# EAGLE design A13-LCD7'' (EAGLE 4.16)
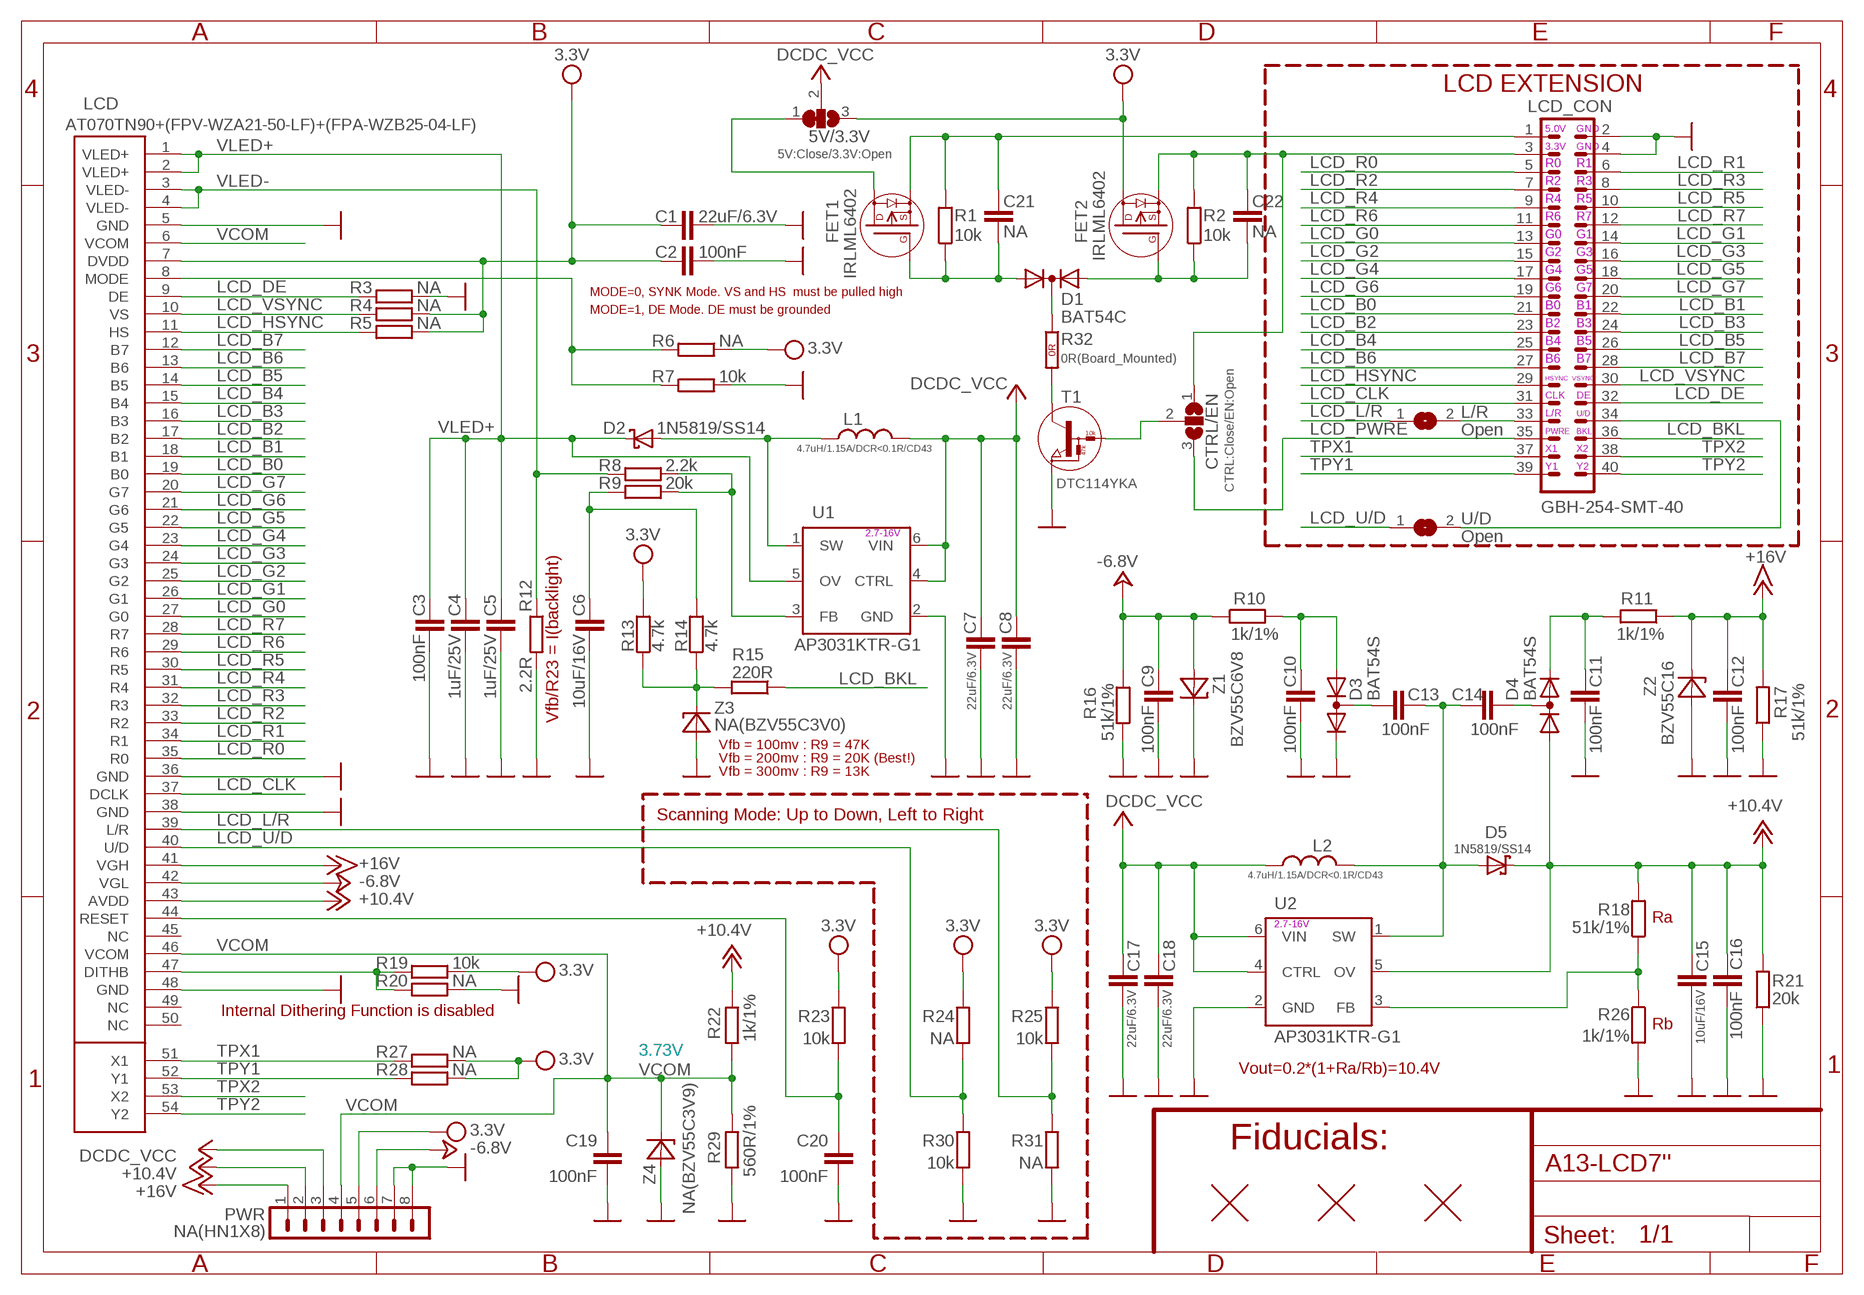
[diagram p0: schematic, sheet 1]

## Parts
5V/3.3V  5V:Close/3.3V:Open  SJ2W3  [SJ_2_SMALL]
C1  22uF/6.3V  C-EUC0805_5MIL_DWS  [C0805_5MIL_DWS]
C2  100nF  C-EUC0603_DWS  [C0603_DWS]
C3  100nF  C-EUC0603_DWS  [C0603_DWS]
C4  1uF/25V  C-EUC0805_5MIL_DWS  [C0805_5MIL_DWS]
C5  1uF/25V  C-EUC0805_5MIL_DWS  [C0805_5MIL_DWS]
C6  10uF/16V  C-EUC0805_5MIL_DWS  [C0805_5MIL_DWS]
C7  22uF/6.3V  C-EUC0805_5MIL_DWS  [C0805_5MIL_DWS]
C8  22uF/6.3V  C-EUC0805_5MIL_DWS  [C0805_5MIL_DWS]
C9  100nF  C-EUC0603_DWS  [C0603_DWS]
C10  100nF  C-EUC0603_DWS  [C0603_DWS]
C11  100nF  C-EUC0603_DWS  [C0603_DWS]
C12  100nF  C-EUC0603_DWS  [C0603_DWS]
C13  100nF  C-EUC0603_DWS  [C0603_DWS]
C14  100nF  C-EUC0603_DWS  [C0603_DWS]
C15  10uF/16V  C-EUC0805_5MIL_DWS  [C0805_5MIL_DWS]
C16  100nF  C-EUC0603_DWS  [C0603_DWS]
C17  22uF/6.3V  C-EUC0805_5MIL_DWS  [C0805_5MIL_DWS]
C18  22uF/6.3V  C-EUC0805_5MIL_DWS  [C0805_5MIL_DWS]
C19  100nF  C-EUC0603_DWS  [C0603_DWS]
C20  100nF  C-EUC0603_DWS  [C0603_DWS]
C21  NA  C-EUC0603_DWS  [C0603_DWS]
C22  NA  C-EUC0603_DWS  [C0603_DWS]
CTRL/EN  CTRL:Close/EN:Open  SJ2W3  [SJ_2_SMALL]
D1  BAT54C  DIODE_AC-CA_  [SOT23C]
D2  1N5819/SS14  SCHOTKKY7.62SS2  [MLL-41]
D3  BAT54S  DIODE_AC-AC_  [SOT23C(BAT54S)]
D4  BAT54S  DIODE_AC-AC_  [SOT23C(BAT54S)]
D5  1N5819/SS14  SCHOTKKY7.62SS2  [MLL-41]
FET1  IRLML6402  P-MOS+DIODIRLML6402  [SOT23]
FET2  IRLML6402  P-MOS+DIODIRLML6402  [SOT23]
L1  4.7uH/1.15A/DCR<0.1R/CD43  L-CD42(43)  [CD42(43)]
L2  4.7uH/1.15A/DCR<0.1R/CD43  L-CD42(43)  [CD42(43)]
L/R  Open  SJSJ_SMALLER  [SJ_1_SMALLER]
LCD  AT070TN90+(FPV-WZA21-50-LF)+(FPA-WZB25-04-LF)  LCD7"_TOUCH  [LCD7"_TOUCH(AT070TN90)]
LCD_CON  GBH-254-SMT-40  ML40-GBH-254-SMT-40  [ML40-MALE(GBH-254-SMT-40)]
PWR  NA(HN1X8)  CON8HN1X8  [HN1X8]
R1  10k  R-EU_R0603_5MIL_DWS  [R0603_5MIL_DWS]
R2  10k  R-EU_R0603_5MIL_DWS  [R0603_5MIL_DWS]
R3  NA  R-EU_R0603_5MIL_DWS  [R0603_5MIL_DWS]
R4  NA  R-EU_R0603_5MIL_DWS  [R0603_5MIL_DWS]
R5  NA  R-EU_R0603_5MIL_DWS  [R0603_5MIL_DWS]
R6  NA  R-EU_R0603_5MIL_DWS  [R0603_5MIL_DWS]
R7  10k  R-EU_R0603_5MIL_DWS  [R0603_5MIL_DWS]
R8  2.2k  R-EU_R0603_5MIL_DWS  [R0603_5MIL_DWS]
R9  20k  R-EU_R0603_5MIL_DWS  [R0603_5MIL_DWS]
R10  1k/1%  R-EU_R0603_5MIL_DWS  [R0603_5MIL_DWS]
R11  1k/1%  R-EU_R0603_5MIL_DWS  [R0603_5MIL_DWS]
R12  2.2R  R-EU_R0603_5MIL_DWS  [R0603_5MIL_DWS]
R13  4.7k  R-EU_R0603_5MIL_DWS  [R0603_5MIL_DWS]
R14  4.7k  R-EU_R0603_5MIL_DWS  [R0603_5MIL_DWS]
R15  220R  R-EU_R0603_5MIL_DWS  [R0603_5MIL_DWS]
R16  51k/1%  R-EU_R0603_5MIL_DWS  [R0603_5MIL_DWS]
R17  51k/1%  R-EU_R0603_5MIL_DWS  [R0603_5MIL_DWS]
R18  51k/1%  R-EU_R0603_5MIL_DWS  [R0603_5MIL_DWS]
R19  10k  R-EU_R0603_5MIL_DWS  [R0603_5MIL_DWS]
R20  NA  R-EU_R0603_5MIL_DWS  [R0603_5MIL_DWS]
R21  20k  R-EU_R0603_5MIL_DWS  [R0603_5MIL_DWS]
R22  1k/1%  R-EU_R0603_5MIL_DWS  [R0603_5MIL_DWS]
R23  10k  R-EU_R0603_5MIL_DWS  [R0603_5MIL_DWS]
R24  NA  R-EU_R0603_5MIL_DWS  [R0603_5MIL_DWS]
R25  10k  R-EU_R0603_5MIL_DWS  [R0603_5MIL_DWS]
R26  1k/1%  R-EU_R0603_5MIL_DWS  [R0603_5MIL_DWS]
R27  NA  R-EU_R0603_5MIL_DWS  [R0603_5MIL_DWS]
R28  NA  R-EU_R0603_5MIL_DWS  [R0603_5MIL_DWS]
R29  560R/1%  R-EU_R0603_5MIL_DWS  [R0603_5MIL_DWS]
R30  10k  R-EU_R0603_5MIL_DWS  [R0603_5MIL_DWS]
R31  NA  R-EU_R0603_5MIL_DWS  [R0603_5MIL_DWS]
R32  0R(Board_Mounted)  R_0R0R(NA)  [0603_0R]
T1  DTC114YKA  DIGITAL_TRANSISTORS-NPNDTC114YKA  [SOT-23]
U1  AP3031KTR-G1  [SOT23-6]
U2  AP3031KTR-G1  [SOT23-6]
U$1  FIDUCIAL1X2  [FIDUCIAL-1X2]
U$2  FIDUCIAL1X2  [FIDUCIAL-1X2]
U$3  FIDUCIAL1X2  [FIDUCIAL-1X2]
U/D  Open  SJSJ_SMALLER  [SJ_1_SMALLER]
Z1  BZV55C6V8  ZDIOD-SMD  [MINI-MELF]
Z2  BZV55C16  ZDIOD-SMD  [MINI-MELF]
Z3  NA(BZV55C3V0)  ZDIOD-SMD  [MINI-MELF]
Z4  NA(BZV55C3V9)  ZDIOD-SMD  [MINI-MELF]

## Nets
+5V: 5V/3.3V.2 C7.2 C8.2 C17.2 C18.2 L1.1 L2.1 PWR.3 U1.4(CTRL) U1.6(VIN) U2.4(CTRL) U2.6(VIN) ; supply symbol labelled DCDC_VCC
+12V: C15.1 C16.1 D4.1(A) D5.K(C) LCD.43(AVDD) PWR.2 R18.2 R21.2 R22.1 U2.5(OV) ; supply symbol labelled +10.4V
+15V: C12.1 LCD.41(VGH) PWR.1 R11.1 R17.2 Z2.1(C) ; supply symbol labelled +16V
-24V: C9.1 LCD.42(VGL) PWR.6 R10.1 R16.2 Z1.2(A) ; supply symbol labelled -6.8V
GND [pwr]: C1.2 C2.2 C3.2 C4.2 C5.2 C6.2 C7.1 C8.1 C9.2 C10.2 C11.2 C12.2 C15.2 C16.2 C17.1 C18.1 C19.2 C20.2 D3.2(K) LCD.5(GND) LCD.36(GND) LCD.38(GND) LCD.48(GND) LCD_CON.2 LCD_CON.4 PWR.7 PWR.8 R3.1 R7.1 R12.2 R16.1 R17.1 R20.1 R21.1 R26.2 R29.2 R30.2 R31.2 T1.2(E) U1.2(GND) U2.2(GND) Z1.1(C) Z2.2(A) Z3.2(A) Z4.2(A)
LCD_B0: LCD.19(B0) LCD_CON.21
LCD_B1: LCD.18(B1) LCD_CON.22
LCD_B2: LCD.17(B2) LCD_CON.23
LCD_B3: LCD.16(B3) LCD_CON.24
LCD_B4: LCD.15(B4) LCD_CON.25
LCD_B5: LCD.14(B5) LCD_CON.26
LCD_B6: LCD.13(B6) LCD_CON.27
LCD_B7: LCD.12(B7) LCD_CON.28
LCD_BKL: LCD_CON.36 R15.1
LCD_CLK: LCD.37(DCLK) LCD_CON.31
LCD_DE: LCD.9(DE) LCD_CON.32 R3.2
LCD_G0: LCD.27(G0) LCD_CON.13
LCD_G1: LCD.26(G1) LCD_CON.14
LCD_G2: LCD.25(G2) LCD_CON.15
LCD_G3: LCD.24(G3) LCD_CON.16
LCD_G4: LCD.23(G4) LCD_CON.17
LCD_G5: LCD.22(G5) LCD_CON.18
LCD_G6: LCD.21(G6) LCD_CON.19
LCD_G7: LCD.20(G7) LCD_CON.20
LCD_HSYNC: LCD.11(HS) LCD_CON.29 R5.2
LCD_L/R: L/R.1 LCD.39(L/R) R25.2 R31.1
LCD_PWRE: CTRL/EN.3 LCD_CON.35
LCD_R0: LCD.35(R0) LCD_CON.5
LCD_R1: LCD.34(R1) LCD_CON.6
LCD_R2: LCD.33(R2) LCD_CON.7
LCD_R3: LCD.32(R3) LCD_CON.8
LCD_R4: LCD.31(R4) LCD_CON.9
LCD_R5: LCD.30(R5) LCD_CON.10
LCD_R6: LCD.29(R6) LCD_CON.11
LCD_R7: LCD.28(R7) LCD_CON.12
LCD_U/D: LCD.40(U/D) R24.2 R30.1 U/D.1
LCD_VSYNC: LCD.10(VS) LCD_CON.30 R4.2
N$1: LCD.8(MODE) R6.2 R7.2
N$2: C14.2 D4.3(AK)
N$3 [pwr]: C22.1 CTRL/EN.1 FET2.2(S) LCD_CON.3 R2.2
N$4: C11.1 D4.2(K) R11.2
N$5: R8.1 R9.1 U1.3(FB)
N$6: C10.1 D3.1(A) R10.2
N$7: C21.1 FET1.2(S) LCD_CON.1 R1.2
N$8: C22.2 D1.1(A1) FET2.1(G) R2.1
N$9: C21.2 D1.2(A2) FET1.1(G) R1.1
N$10: C13.1 D3.3(AK)
N$11: R32.2(1.2) T1.3(C)
N$12: C6.1 R9.2 R14.2
N$13: D2.A L1.2 U1.1(SW)
N$14: R13.1 R14.1 R15.2 Z3.1(C)
N$15: L/R.2 LCD_CON.33
N$16: CTRL/EN.2 T1.1(B)
N$17: LCD_CON.34 U/D.2
N$18: 5V/3.3V.1 FET1.3(D)
N$19: D1.3(K) R32.1(1.1)
N$42: LCD.47(DITHB) R19.2 R20.2
N$123: C13.2 C14.1 D5.A L2.2 U2.1(SW)
N$126: R18.1 R26.1 U2.3(FB)
RESET: C20.1 LCD.44(RESET) R23.2
TPX1: LCD.51(X1) LCD_CON.37 R27.2
TPX2: LCD.53(X2) LCD_CON.38
TPY1: LCD.52(Y1) LCD_CON.39 R28.2
TPY2: LCD.54(Y2) LCD_CON.40
VCC [pwr]: 5V/3.3V.3 C1.1 C2.1 FET2.3(D) LCD.7(DVDD) PWR.5 R4.1 R5.1 R6.1 R13.2 R19.1 R23.1 R24.1 R25.1 R27.1 R28.1 ; supply symbol labelled 3.3V
VCOM: C19.1 LCD.6(VCOM) LCD.46(VCOM) PWR.4 R22.2 R29.1 Z4.1(C)
VLED+: C3.1 C4.1 C5.1 D2.K(C) LCD.1(VLED+) LCD.2(VLED+) U1.5(OV)
VLED-: LCD.3(VLED-) LCD.4(VLED-) R8.2 R12.1
Unconnected: LCD.45(NC) LCD.49(NC) LCD.50(NC)

## Notes on the sheet
- LCD EXTENSION
- 5.0V | GND
- 3.3V | GND
- R0 | R1
- R2 | R3
- R4 | R5
- R6 | R7
- G0 | G1
- G2 | G3
- G4 | G5
- G6 | G7
- MODE=0, SYNK Mode. VS and HS  must be pulled high
- B0 | B1
- MODE=1, DE Mode. DE must be grounded
- B2 | B3
- B4 | B5
- B6 | B7
- HSYNC | VSYNC
- CLK | DE
- L/R | U/D
- PWRE | BKL
- X1 | X2
- Y1 | Y2
- 2.7-16V
- Vfb/R23 = I(backlight)
- Vfb = 100mv : R9 = 47K
- Vfb = 200mv : R9 = 20K (Best!)
- Vfb = 300mv : R9 = 13K
- Scanning Mode: Up to Down, Left to Right
- Ra
- 2.7-16V
- Internal Dithering Function is disabled
- Rb
- 3.73V
- Vout=0.2*(1+Ra/Rb)=10.4V
- Fiducials:

## Library data of the parts
5V/3.3V CTRL/EN = jumper:SJ2W: SMD solder JUMPER
C1-C22 = rcl:C-EU: CAPACITOR, European symbol
D1 = semicon-smd-ipc:DIODE_AC-CA_: DUAL DIODE
D2 D5 = gogo:SCHOTKKY7.62SS
D3 D4 = semicon-smd-ipc:DIODE_AC-AC_: DUAL DIODE
FET1 FET2 = Penko:P-MOS+DIOD
L1 L2 = OLIMEX_DISCRET:L
L/R U/D = jumper:SJ: SMD solder JUMPER
LCD = olimex_lcd:LCD7"_TOUCH
LCD_CON = con-harting-ml:ML40: HARTING
PWR = Penko:CON8
R1-R31 = rcl:R-EU_: RESISTOR, European symbol
R32 = OLIMEX_DISCRET:R_0R
T1 = OLIMEX_DISCRET:DIGITAL_TRANSISTORS-NPN: DTC114YKA Digital Transistor - NPN
U1 U2 = OLIMEX_IC:AP3031
U$1-U$3 = SparkFunEagle-6-6-07:FIDUCIAL: Fiducial Alignment Points Various fiducial points for machine vision alignment.
Z1-Z4 = gogo:ZDIOD-SMD

## Net classes
1 pwr: width 0.254 mm, drill 0.241 mm, clearance 0.254 mm

## Board
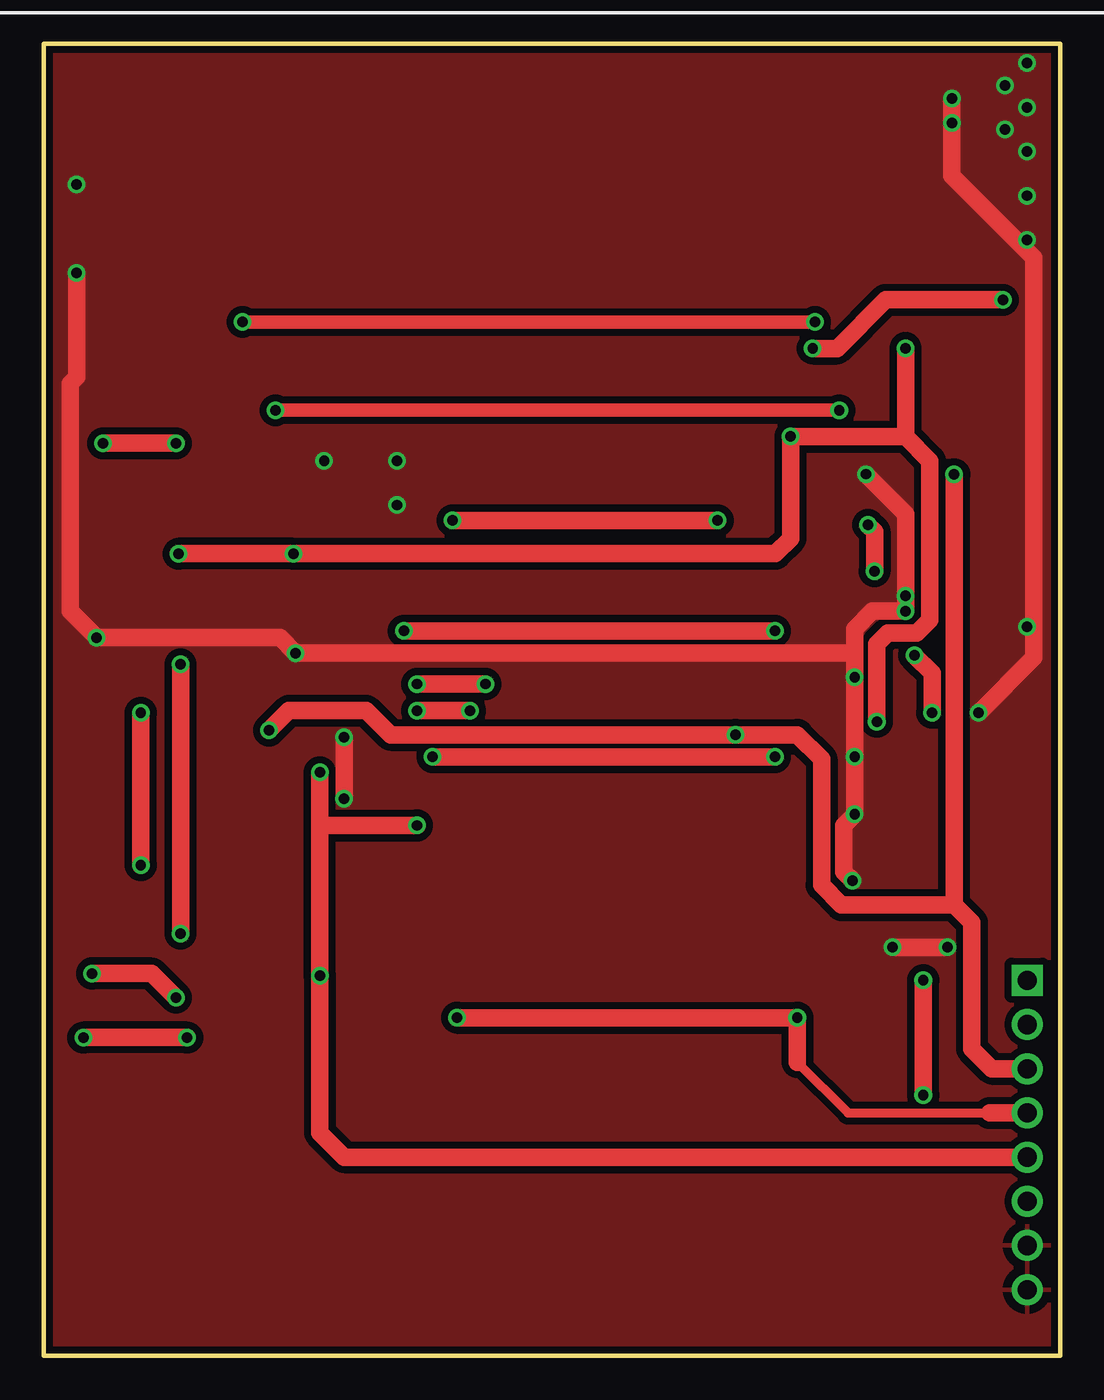
[diagram p1: board, top side]
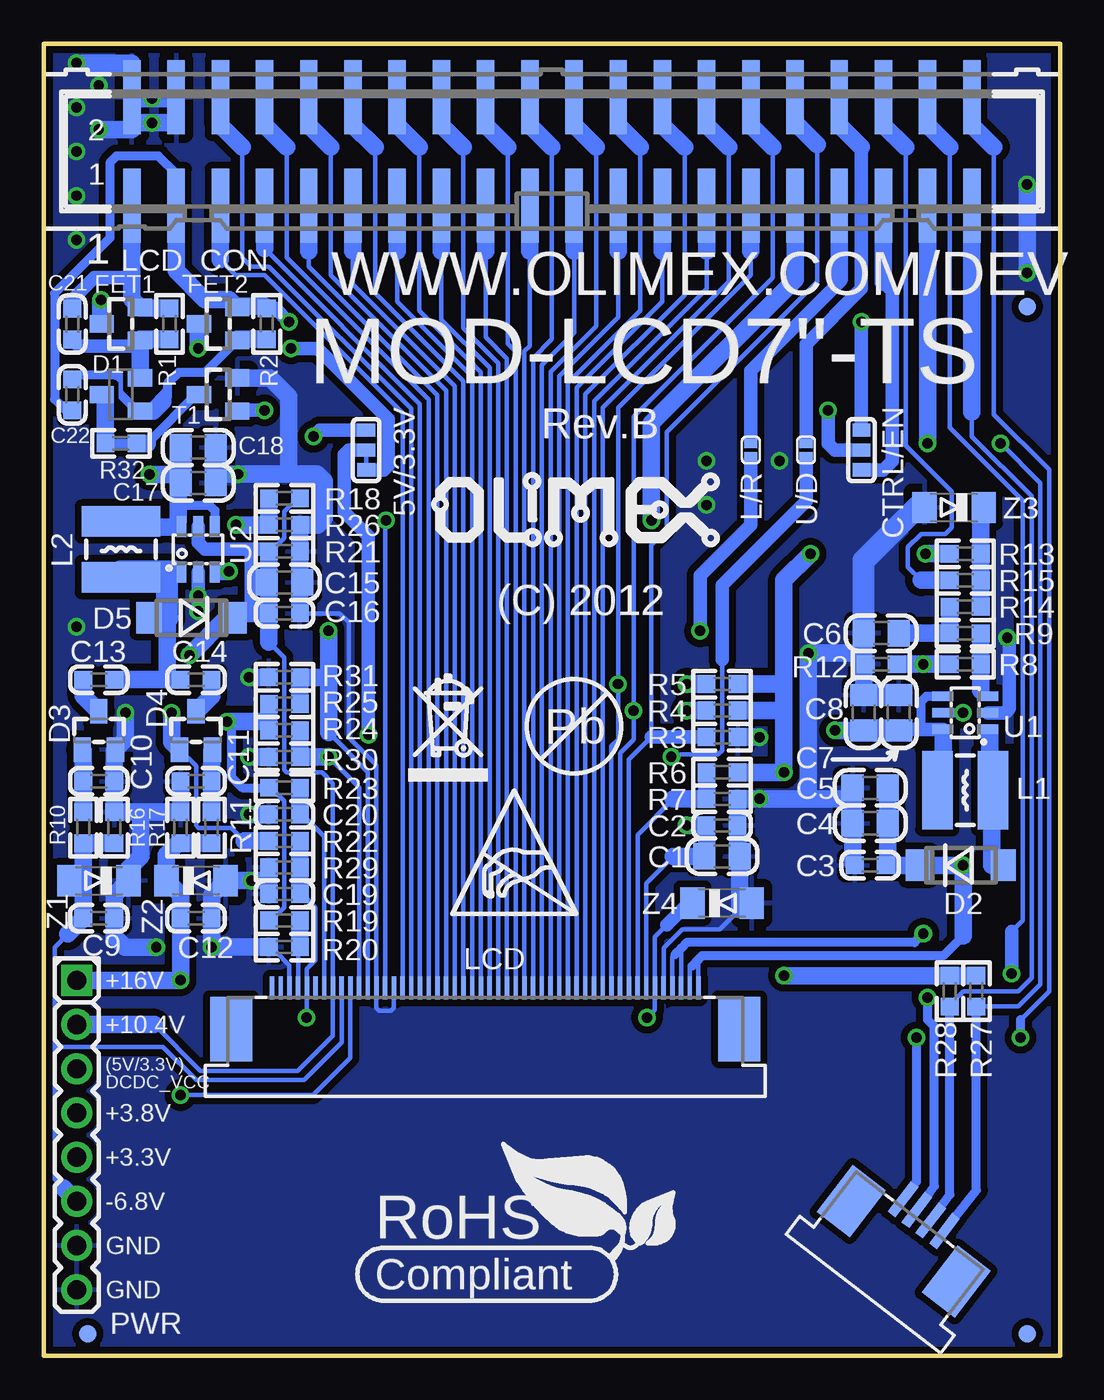
[diagram p2: board, bottom side, seen from below]

Size 58.42 x 75.44 mm. Coordinates in mm from the lower left corner, seen from the top.
Outline: 0,75.44 0,0 58.42,0 58.42,75.44 0,75.44
Copper layers (1+16): Top 0.035mm / dielectric 1.5mm / Bottom 0.035mm
Design rules "default": minimum track width 9.5mil, minimum drill 0.6mm, track to track 9.5mil, track to pad 9.5mil, pad to pad 9.5mil, via to via 10mil, smd to smd 1mil, copper to edge 10mil, drill to drill 8mil, minimum pad ring 8mil, minimum via ring 8mil, stop-mask expansion 4mil, vias tented up to drill 25mil, thermal gap 20mil

### Footprints (pad centres in the part's own frame; a part is rotated, then mirrored left to right if it is on the bottom)
SJ_2_SMALL = smd 0.762 x 1.016: 1 -1.143,0; 2 0,0; 3 1.143,0
C0805_5MIL_DWS = smd 1.27 x 1.524: 1 -1.016,0; 2 1.016,0
C0603_DWS = smd 1.016 x 1.016: 1 -0.889,0; 2 0.889,0
SOT23C = smd 1 x 1.4: 1 -0.95,-1.1; 2 0.95,-1.1; 3 0,1.1
MLL-41 = smd 1.45 x 1.8: A 2.445,0; K -2.445,0
SOT23C(BAT54S) = smd 1 x 1.4: 1 -0.95,-1.1; 2 0.95,-1.1; 3 0,1.1
SOT23 = smd 1 x 1.4: 1 -0.95,-1.1; 2 0.95,-1.1; 3 0,1.1
CD42(43) = smd 4.5 x 1.75: 1 0,1.6; 2 0,-1.6
SJ_1_SMALLER = smd 0.508 x 0.762: 1 -0.381,0; 2 0.381,0
LCD7"_TOUCH(AT070TN90) = smd 0.25 x 1.3 bottom: 1 69.05,40.45; 2 69.55,40.45; 3 70.05,40.45; 4 70.55,40.45; 5 71.05,40.45; 6 71.55,40.45; 7 72.05,40.45; 8 72.55,40.45; 9 73.05,40.45; 10 73.55,40.45; 11 74.05,40.45; 12 74.55,40.45; 13 75.05,40.45; 14 75.55,40.45; 15 76.05,40.45; 16 76.55,40.45; 17 77.05,40.45; 18 77.55,40.45; 19 78.05,40.45; 20 78.55,40.45; 21 79.05,40.45; 22 79.55,40.45; 23 80.05,40.45; 24 80.55,40.45; 25 81.05,40.45; 26 81.55,40.45; 27 82.05,40.45; 28 82.55,40.45; 29 83.05,40.45; 30 83.55,40.45; 31 84.05,40.45; 32 84.55,40.45; 33 85.05,40.45; 34 85.55,40.45; 35 86.05,40.45; 36 86.55,40.45; 37 87.05,40.45; 38 87.55,40.45; 39 88.05,40.45; 40 88.55,40.45; 41 89.05,40.45; 42 89.55,40.45; 43 90.05,40.45; 44 90.55,40.45; 45 91.05,40.45; 46 91.55,40.45; 47 92.05,40.45; 48 92.55,40.45; 49 93.05,40.45; 50 93.55,40.45 | smd 0.55 x 2.2 rotated 217.5 bottom: 51 54.913,26.473; 52 55.707,27.082; 53 56.5,27.691; 54 57.294,28.299 | smd 2.4 x 3.7 bottom: P1 95.9,38.075; P2 66.7,38.075 | smd 2.4 x 3.4 rotated 217.5 bottom: P3 60.275,28.192; P4 54.245,23.566
ML40-MALE(GBH-254-SMT-40) = smd 1 x 4.25: 1 -24.13,-3.125; 2 -24.13,3.125; 3 -21.59,-3.125; 4 -21.59,3.125; 5 -19.05,-3.125; 6 -19.05,3.125; 7 -16.51,-3.125; 8 -16.51,3.125; 9 -13.97,-3.125; 10 -13.97,3.125; 11 -11.43,-3.125; 12 -11.43,3.125; 13 -8.89,-3.125; 14 -8.89,3.125; 15 -6.35,-3.125; 16 -6.35,3.125; 17 -3.81,-3.125; 18 -3.81,3.125; 19 -1.27,-3.125; 20 -1.27,3.125; 21 1.27,-3.125; 22 1.27,3.125; 23 3.81,-3.125; 24 3.81,3.125; 25 6.35,-3.125; 26 6.35,3.125; 27 8.89,-3.125; 28 8.89,3.125; 29 11.43,-3.125; 30 11.43,3.125; 31 13.97,-3.125; 32 13.97,3.125; 33 16.51,-3.125; 34 16.51,3.125; 35 19.05,-3.125; 36 19.05,3.125; 37 21.59,-3.125; 38 21.59,3.125; 39 24.13,-3.125; 40 24.13,3.125
HN1X8 = drill 1.1 pad 1.778 square: 1 -8.89,0 | drill 1.1 pad 1.778 round: 2 -6.35,0; 3 -3.81,0; 4 -1.27,0; 5 1.27,0; 6 3.81,0; 7 6.35,0; 8 8.89,0
R0603_5MIL_DWS = smd 1.016 x 1.016: 1 -0.889,0; 2 0.889,0
0603_0R = smd 1.016 x 1.016: 1 -0.889,0; 2 0.889,0
SOT-23 = smd 1 x 1.4: 1 -0.95,-1.1; 2 0.95,-1.1; 3 0,1.1
SOT23-6 = smd 0.55 x 1.2: 1 -0.95,-1.3; 2 0,-1.3; 3 0.95,-1.3; 4 0.95,1.3; 5 0,1.3; 6 -0.95,1.3
FIDUCIAL-1X2 = smd 1 x 1: 1 0,0
MINI-MELF = smd 1.4 x 1.8: 1 -1.7,0; 2 1.7,0

### Placement (x,y rotation side)
5V/3.3V  39.88,52.07 90 bottom
C1  19.43,28.72 0 bottom
C2  19.43,30.5 0 bottom
C3  10.92,28.21 180 bottom
C4  10.92,30.62 180 bottom
C5  10.92,32.65 180 bottom
C6  10.29,41.54 180 bottom
C7  9.27,36.97 270 bottom
C8  11.3,36.97 270 bottom
C9  55.24,25.16 0 bottom
C10  55.24,33.03 0 bottom
C11  49.66,33.03 180 bottom
C12  49.66,25.16 0 bottom
C13  55.24,38.88 0 bottom
C14  49.66,38.88 0 bottom
C15  44.58,44.47 0 bottom
C16  44.58,42.69 0 bottom
C17  49.53,50.18 180 bottom
C18  49.53,52.21 180 bottom
C19  44.58,26.56 180 bottom
C20  44.58,31.13 180 bottom
C21  56.77,59.31 270 bottom
C22  56.77,55.24 90 bottom
CTRL/EN  11.43,52.07 270 bottom
D1  53.98,55.26 90 bottom
D2  5.71,28.21 0 bottom
D3  55.24,35.96 0 bottom
D4  49.66,35.96 0 bottom
D5  49.91,42.43 180 bottom
FET1  53.98,59.32 90 bottom
FET2  48.39,59.32 90 bottom
L1  5.46,32.53 90 bottom
L2  53.98,46.37 0 bottom
L/R  17.78,52.07 90 bottom
LCD  -48.26,-19.29 0 top
LCD_CON  29.21,69.23 0 bottom
PWR  56.52,12.7 270 bottom
R1  51.18,59.32 90 bottom
R2  45.59,59.32 90 bottom
R3  19.43,35.58 180 bottom
R4  19.43,37.1 180 bottom
R5  19.43,38.62 180 bottom
R6  19.43,33.54 180 bottom
R7  19.43,32.02 180 bottom
R8  5.46,39.77 180 bottom
R9  5.46,41.54 180 bottom
R10  56.13,30.37 90 bottom
R11  48.77,30.37 90 bottom
R12  10.29,39.77 180 bottom
R13  5.46,46.12 180 bottom
R14  5.46,43.07 180 bottom
R15  5.46,44.59 0 bottom
R16  54.36,30.37 270 bottom
R17  50.55,30.37 270 bottom
R18  44.58,49.29 0 bottom
R19  44.58,25.03 0 bottom
R20  44.58,23.51 0 bottom
R21  44.58,46.24 180 bottom
R22  44.58,29.61 0 bottom
R23  44.58,32.65 0 bottom
R24  44.58,35.96 0 bottom
R25  44.58,37.48 0 bottom
R26  44.58,47.77 0 bottom
R27  4.83,20.97 270 bottom
R28  6.35,20.97 270 bottom
R29  44.58,28.08 180 bottom
R30  44.58,34.43 180 bottom
R31  44.58,39 180 bottom
R32  53.98,52.45 0 bottom
T1  48.39,55.26 90 bottom
U1  5.46,36.97 90 bottom
U2  49.53,46.37 0 bottom
U$1  1.91,1.27 270 bottom
U$2  55.88,1.27 270 bottom
U$3  1.91,60.33 270 bottom
U$8  [OLIMEX1_V]  18.41,46.37 0 bottom
U$9  [PB]  27.94,36.2 0 bottom
U$10  [ESD_SYMBOL]  34.92,25.4 0 bottom
U$11  [RECYCLE_BIN1/8]  37.47,33.02 0 bottom
U$12  [ROHS]  39.37,3.81 0 bottom
U/D  14.61,52.07 90 bottom
Z1  55.24,27.32 180 bottom
Z2  49.66,27.32 0 bottom
Z3  6.1,48.77 180 bottom
Z4  19.43,26.04 0 bottom

### Tracks (layer width: path | path; a pad name or v marks a point on that pad's centre or on a via)
+5V  (via drill 0.6)
  Top 1.016: v12.95,35.96 14.1,37.1 18.54,37.1 19.94,35.7 v39.75,35.7 43.31,35.7 44.7,34.3 44.7,27.07 45.85,25.92 52.32,25.92 | 52.32,25.92 v52.32,50.67 | 52.32,25.92 53.34,24.91 53.34,17.65 54.48,16.51 PWR.3
  Bottom 0.254: 5V/3.3V.2 39.88,51.05
  Bottom 0.508: 50.67,48.02 50.67,47.67 | 50.67,47.67 U2.6 | 50.67,47.67 50.67,47.64 50.8,47.64 | U2.4 48.58,48.59 48.9,48.91 50.67,48.91 | 6.73,36.02 U1.6 | U1.4 7.69,37.92 8,37.61 8,36.02 | 9.27,36.02 C7.2
  Bottom 0.762: 6.73,35.7 6.73,36.02 | U1.6 8,36.02 9.27,36.02 | 5V/3.3V.2 40.89,52.07 41.15,51.82 41.15,48.51 39.75,47.12 v39.75,35.7
  Bottom 1.016: v52.32,50.67 50.55,50.67 | 50.67,48.02 50.67,48.91 50.67,50.18 C17.2 | L2.1 53.98,47.64 50.8,47.64 | L1.1 6.73,32.53 6.73,35.7 | C8.2 v12.95,35.96
  Bottom 1.27: C18.2 50.55,50.67 C17.2 | C7.2 C8.2
+12V  (via drill 0.6, 0.6 pad 1.02)
  Top 1.016: v50.04,40.27 51.05,39.26 v51.05,36.97
  Bottom 0.254: 45.47,46.37 45.21,46.37 44.58,47.01 44.58,48.53 43.81,49.29 R18.2 | 45.47,41.04 44.58,40.15 44.58,33.67 44.45,33.54 42.42,33.54 41.79,32.91 LCD.43 41.79,18.41 43.81,16.38 49.4,16.38 52.07,19.05 | 46.88,29.61 47.63,30.36 49.53,30.36 49.66,30.48 49.66,33.91 D4.1
  Bottom 0.762: U2.5 49.53,46.75 49.15,46.37 46.48,46.37 | R21.2 45.47,46.37 46.48,46.37 | 46.48,42.69 46.48,44.47 | 46.48,44.47 46.48,46.37 | 45.47,44.47 46.48,44.47
  Bottom 1.016: 45.47,44.47 R21.2 | 45.47,44.47 C15.1 | C16.1 45.47,44.47 | C16.1 46.48,42.69 46.48,42.67 47.23,42.67 D5.K 47.88,42.43 v50.04,40.27 | 45.47,41.04 C16.1 | D4.1 51.05,35.3 v51.05,36.97 | 46.88,29.61 R22.1 | 52.07,19.05 PWR.2
+15V  (via drill 0.6)
  Top 1.016: v50.55,15 v50.55,21.61
  Bottom 0.254: LCD.41 40.79,17.12 42.91,15 v50.55,15
  Bottom 1.016: R11.1 R17.2 50.67,29.48 51.36,28.8 Z2.1 50.55,26.51 C12.1 v50.55,21.61 50.56,21.59 PWR.1
-24V
  Bottom 0.254: LCD.42 41.29,18.03 43.45,15.88 49.66,15.88 51.56,17.78 57.78,17.78 | 57.02,24.26 57.78,23.5 57.78,17.78 | 57.28,9.65 57.78,10.16 57.78,17.78
  Bottom 1.016: R16.2 R10.1 56.13,27.32 | 56.13,27.32 Z1.2 | 56.13,27.32 C9.1 56.13,25.15 57.02,24.26 | 57.28,9.65 PWR.6
GND  (via drill 0.6, 0.6 pad 1.02)
  Top 1.016: v47.24,50.69 49.53,48.4 v49.53,43.7 v49.53,42.81 47.62,42.81 46.61,41.8 46.61,40.4 | v46.48,27.32 45.97,27.83 45.97,30.5 v46.61,31.13 v46.61,34.43 v46.61,39 46.61,40.4 | v52.2,72.28 v52.2,70.88 52.2,67.83 56.9,63.13 56.9,40.15 v53.72,36.97 | 46.61,40.4 v14.48,40.4 13.59,41.29 v3.05,41.29 1.52,42.81 1.52,55.88 1.91,56.26 v1.91,62.24 | v17.27,32.02 v17.27,35.58 | v48.77,23.51 48.77,23.5 v51.94,23.5
  Bottom 0.254: LCD.48 44.29,22.46 45.09,23.26 45.09,23.51 R20.1 | C16.2 41.4,42.69 40.89,42.18 40.89,35.56 39.29,33.96 LCD.38 39.29,20 39.12,19.83 38.48,19.83 38.29,20.02 LCD.36 | LCD.5 22.79,23.45 21.73,24.51 19.57,24.51 18.41,25.67
  Bottom 0.762: 49.53,43.67 U2.2 | v49.53,43.7 49.53,43.67 | v49.53,42.81 49.53,43.67 | U1.2 3.17,36.97 2.92,37.23 2.92,41.16 v3.05,41.29
  Bottom 1.016: 48.51,50.69 v47.24,50.69 44.32,50.69 | 43.69,44.47 R21.1 R26.2 42.67,47.77 42.29,48.15 42.29,50.29 42.69,50.69 44.32,50.69 | 43.69,44.47 C15.2 | 43.69,44.47 C16.2 | C11.2 R17.1 52.83,31.26 | D3.2 54.36,34.8 54.36,34.81 | 54.36,34.81 C10.2 R16.1 52.83,31.26 | 52.83,31.26 52.83,28.72 53.55,28 Z1.1 54.36,26.51 C9.2 54.36,24.13 53.72,23.5 v51.94,23.5 | 45.47,27.32 R29.2 | 45.47,27.32 v46.48,27.32 Z2.2 48.77,26.51 C12.2 v48.77,23.51 R20.1 | 45.47,27.32 C19.2 | v46.61,31.13 C20.2 | v46.61,34.43 R30.2 | v46.61,39 R31.2 | 53.34,72.28 LCD_CON.2 53.34,74.3 56.52,74.3 | 53.34,72.28 v52.2,72.28 50.8,72.28 | 50.8,72.28 LCD_CON.4 | C3.2 11.94,28.34 C4.2 11.94,32.02 | 11.94,32.02 C5.2 | 11.3,39.77 C8.1 | 11.3,39.77 R12.2 | 11.3,40.4 C6.2 | 11.3,40.4 v14.48,40.4 14.48,32.02 | 11.3,40.4 11.3,39.77 | 18.41,26.04 C1.2 18.54,28.72 C2.2 R7.1 v17.27,32.02 14.48,32.02 | 18.41,26.04 18.41,25.67 | v17.27,35.58 R3.1 | 11.94,32.02 14.48,32.02 | v53.72,36.97 53.72,35.45 54.36,34.81 | T1.2 45.4,56.21 44.32,55.13 44.32,50.69 | 50.8,72.28 50.8,70.88 v52.2,70.88 53.34,70.88 53.34,72.28 | 18.41,26.04 Z4.2 | v1.91,62.24 v1.91,67.33 | 53.34,72.28 53.34,70.48 v55.24,70.48
  Bottom 1.27: C17.1 48.51,50.69 C18.1 | C8.1 C7.1 | C6.2 11.3,45.72 8.26,48.77 Z3.2
  other vias: 56.52,74.31 56.52,71.77 56.52,69.23 56.52,66.69 56.52,41.92 20.32,51.45 20.32,48.91 16.13,51.45 55.24,73.03 56.52,64.15
  pour Top (isolate 0.406, rank 2): -2.54,78.74 -2.54,-2.54 60.96,-2.54 60.96,78.74
  pour Bottom (isolate 0.406, rank 3): -5.08,-5.08 63.5,-5.08 63.5,81.28 -5.08,81.28
LCD_B0
  Bottom 0.254: LCD.19 29.79,56.97 27.94,58.82 27.94,63.52
  Bottom 1.016: 27.94,63.52 LCD_CON.21
LCD_B1
  Bottom 0.254: LCD.18 29.29,56.58 26.67,59.2 26.67,69.48
  Bottom 1.016: LCD_CON.22 27.94,70.75 26.67,69.48
LCD_B2
  Bottom 0.254: LCD.17 28.79,56.31 25.4,59.7 25.4,63.52
  Bottom 1.016: 25.4,63.52 LCD_CON.23
LCD_B3
  Bottom 0.254: LCD.16 28.29,55.93 24.13,60.09 24.13,69.48
  Bottom 1.016: LCD_CON.24 25.4,70.75 24.13,69.48
LCD_B4
  Bottom 0.254: LCD.15 27.79,55.66 22.86,60.59 22.86,63.52
  Bottom 1.016: 22.86,63.52 LCD_CON.25
LCD_B5
  Bottom 0.254: LCD.14 27.29,55.27 21.59,60.98 21.59,69.48
  Bottom 1.016: LCD_CON.26 22.86,70.75 21.59,69.48
LCD_B6
  Bottom 0.254: LCD.13 26.79,54.89 20.32,61.36 20.32,63.52
  Bottom 1.016: 20.32,63.52 LCD_CON.27
LCD_B7
  Bottom 0.254: LCD.12 26.29,54.5 19.05,61.74 19.05,69.48
  Bottom 1.016: LCD_CON.28 20.32,70.75 19.05,69.48
LCD_BKL
  Bottom 0.254: 8,44.59 8.76,45.35 8.76,46.48 8,47.24 6.6,47.24 6.22,47.62 6.22,49.67 8.89,52.34 8.89,69.48
  Bottom 1.016: LCD_CON.36 10.16,70.75 8.89,69.48 | R15.1 8,44.59
LCD_CLK  (via drill 0.6)
  Top 1.016: v38.73,48.02 v23.5,48.02
  Bottom 0.254: LCD.37 38.79,47.97 v38.73,48.02
  Bottom 1.016: LCD_CON.31 15.24,61.86 23.5,53.61 v23.5,48.02
LCD_DE
  Bottom 0.254: LCD.9 24.79,34.28 23.5,35.58 23.5,46.62 22.61,47.51 22.61,53.1 13.97,61.74 13.97,69.61
  Bottom 0.762: 23.5,35.58 R3.2
  Bottom 1.016: LCD_CON.32 15.24,70.88 13.97,69.61
LCD_G0
  Bottom 0.254: LCD.27 33.79,56.28 38.1,60.59 38.1,63.52
  Bottom 1.016: 38.1,63.52 LCD_CON.13
LCD_G1
  Bottom 0.254: LCD.26 33.29,56.55 36.83,60.09 36.83,69.48
  Bottom 1.016: LCD_CON.14 38.1,70.75 36.83,69.48
LCD_G2
  Bottom 0.254: LCD.25 32.79,56.81 35.56,59.58 35.56,63.52
  Bottom 1.016: 35.56,63.52 LCD_CON.15
LCD_G3
  Bottom 0.254: LCD.24 32.29,57.07 34.29,59.07 34.29,69.48
  Bottom 1.016: LCD_CON.16 35.56,70.75 34.29,69.48
LCD_G4
  Bottom 0.254: LCD.23 31.79,57.33 33.02,58.56 33.02,63.52
  Bottom 1.016: 33.02,63.52 LCD_CON.17
LCD_G5
  Bottom 0.254: LCD.22 31.29,57.72 31.75,58.18 31.75,69.48
  Bottom 1.016: LCD_CON.18 33.02,70.75 31.75,69.48
LCD_G6
  Bottom 0.254: LCD.21 30.79,57.74 30.48,58.05 30.48,63.52
  Bottom 1.016: 30.48,63.52 LCD_CON.19
LCD_G7
  Bottom 0.254: LCD.20 30.29,57.35 29.21,58.44 29.21,69.48
  Bottom 1.016: LCD_CON.20 30.48,70.75 29.21,69.48
LCD_HSYNC  (via drill 0.6)
  Top 1.016: v25.4,38.62 v21.46,38.62
  Bottom 0.254: LCD.11 25.79,35.06 25.4,35.45 v25.4,38.62 25.4,54.5 17.78,62.12 17.78,63.52
  Bottom 1.016: 17.78,63.52 LCD_CON.29 | v21.46,38.62 R5.2
LCD_L/R  (via drill 0.6)
  Top 1.016: v42.04,41.67 v20.7,41.67
  Bottom 0.254: LCD.39 39.79,33.58 42.04,35.83 | R31.1 R25.2
  Bottom 0.508: 17.78,51.56 L/R.1
  Bottom 0.762: v20.7,41.67 20.7,44.85 18.92,46.62 18.92,46.61 17.78,47.75 17.78,51.56
  Bottom 1.016: 42.04,35.83 42.04,39 | 42.04,39 R31.1 R25.2 | 42.04,39 v42.04,41.67
LCD_PWRE
  Bottom 0.762: CTRL/EN.3 10.16,50.93 9.65,51.44 9.65,61.21 10.16,61.72
  Bottom 1.016: 10.16,61.72 LCD_CON.35
LCD_R0
  Bottom 0.254: LCD.35 37.79,54.19 45.72,62.12 47.37,62.12 48.26,63.01
  Bottom 1.016: 48.26,63.01 LCD_CON.5
LCD_R1
  Bottom 0.254: 46.99,69.48 46.99,63.13 46.48,62.63 45.47,62.63 37.29,54.45 LCD.34
  Bottom 1.016: LCD_CON.6 48.26,70.75 46.99,69.48
LCD_R2
  Bottom 0.254: LCD.33 36.79,54.71 45.72,63.64
  Bottom 1.016: 45.72,63.64 LCD_CON.7
LCD_R3
  Bottom 0.254: LCD.32 36.29,54.97 44.45,63.13 44.45,69.48
  Bottom 1.016: LCD_CON.8 45.72,70.75 44.45,69.48
LCD_R4
  Bottom 0.254: LCD.31 35.79,55.24 43.18,62.63 43.18,63.52
  Bottom 1.016: 43.18,63.52 LCD_CON.9
LCD_R5
  Bottom 0.254: LCD.30 35.29,55.5 41.91,62.12 41.91,69.48
  Bottom 1.016: LCD_CON.10 43.18,70.75 41.91,69.48
LCD_R6
  Bottom 0.254: LCD.29 34.79,55.76 40.64,61.61 40.64,63.52
  Bottom 1.016: 40.64,63.52 LCD_CON.11
LCD_R7
  Bottom 0.254: LCD.28 34.29,56.02 39.37,61.1 39.37,69.48
  Bottom 1.016: LCD_CON.12 40.64,70.75 39.37,69.48
LCD_U/D  (via drill 0.6)
  Top 1.016: v22.35,34.43 v42.04,34.43
  Bottom 0.254: LCD.40 40.29,32.69 v42.04,34.43 | 19.43,40.02 19.43,34.81 19.68,34.56 22.23,34.56 v22.35,34.43
  Bottom 0.508: 14.61,51.56 U/D.1
  Bottom 0.762: 19.43,40.02 19.43,44.32 14.61,49.15 14.61,51.56
  Bottom 1.016: v42.04,34.43 R30.1 R24.2
LCD_VSYNC  (via drill 0.6)
  Top 1.016: v24.51,37.1 v21.46,37.1
  Bottom 0.254: LCD.10 25.29,34.67 24.51,35.45 v24.51,37.1 24.51,53.99 16.51,61.99 16.51,69.48
  Bottom 1.016: LCD_CON.30 17.78,70.75 16.51,69.48 | v21.46,37.1 R4.2
N$1
  Bottom 0.254: LCD.8 24.29,29.95 22.23,32.02
  Bottom 1.016: 22.23,32.02 R7.2 R6.2
N$2
  Bottom 1.016: D4.3 48.77,37.95 C14.2
N$3  (via drill 0.6)
  Top 0.762: v11.43,59.44 v44.32,59.44
  Bottom 0.508: C22.1 57.15,54.36 57.78,54.99 57.78,61.09 54.61,64.26 54.61,68.58 54.23,68.96 51.82,68.96 50.8,67.94 LCD_CON.3
  Bottom 0.762: CTRL/EN.1 v11.43,59.44 | R2.2 45.1,60.21 v44.32,59.44
  Bottom 1.016: LCD_CON.3 50.8,62.37 49.15,60.72 47.75,60.72 47.29,60.26 FET2.2 47.29,60.34 45.72,60.34 R2.2
N$4
  Bottom 1.016: D4.2 48.77,34.8 C11.1 R11.2
N$5
  Bottom 0.508: U1.3 4.57,37.92 4.57,38.24
  Bottom 1.016: R9.1 R8.1 4.57,38.24
N$6
  Bottom 1.016: D3.1 56.13,34.8 C10.1 R10.2
N$7
  Bottom 0.762: C21.1 56.77,60.71 55.5,61.98 53.34,61.98
  Bottom 1.016: LCD_CON.1 53.34,61.98 53.34,60.74 FET1.2 52.88,60.21 R1.2
N$8
  Bottom 0.254: 53.85,55.12 53.98,55.24 53.98,55.42 | 53.98,55.42 53.98,56.01 | 53.98,56.01 53.98,56.26 54.1,56.39 | 53.98,55.42 53.85,55.3 | 53.98,56.01 54.36,56.39
  Bottom 0.508: FET2.1 47.3,58.37 49.15,56.53 50.66,56.53 51.31,55.88 51.31,55.47 | 51.56,54.86 51.31,55.12 51.31,55.47 | D1.1 53.04,54.31 53.85,55.12 | C22.2 56.77,56.39 54.36,56.39 54.1,56.39 | 51.31,55.47 51.82,54.97
  Bottom 1.016: FET2.1 47.29,58.44 R2.1 | D1.1 52.12,54.31 51.56,54.86
N$9
  Bottom 0.762: C21.2 56.39,58.04 52.88,58.04
  Bottom 1.016: 52.83,58.37 FET1.1 52.88,58.44 | 52.88,58.44 R1.1 | 52.88,58.44 52.88,58.04 D1.2
N$10
  Bottom 1.016: D3.3 56.13,37.95 C13.1
N$11
  Bottom 0.508: T1.3 49.49,55.43 52.47,52.45
  Bottom 1.016: R32.2 52.47,52.45
N$12
  Bottom 1.016: C6.1 R9.2 R14.2
N$13
  Bottom 0.508: L1.2 4.06,32.53 | U1.1 4.06,36.02 4.06,35.77
  Bottom 1.016: 4.06,32.53 4.06,35.77 | D2.A 3.94,28.21 3.94,32.53 L1.2
N$14
  Bottom 1.016: R14.1 R15.2 R13.1 4.57,48.59 Z3.1
N$15
  Bottom 0.508: L/R.2 17.78,52.58
  Bottom 0.762: 17.78,52.58 17.78,56.64 12.7,61.72 12.7,61.9
  Bottom 1.016: 12.7,61.9 LCD_CON.33
N$16  (via drill 0.6)
  Top 0.762: v13.34,54.36 v45.72,54.36
  Bottom 0.762: T1.1 47.29,54.36 v45.72,54.36 | CTRL/EN.2 12.95,52.07 13.34,52.45 v13.34,54.36
N$17
  Bottom 0.508: U/D.2 14.61,52.58
  Bottom 0.762: 11.43,69.47 11.43,61.34 14.61,58.17 14.61,52.58
  Bottom 1.016: LCD_CON.34 12.7,70.74 11.43,69.47
N$18  (via drill 0.6)
  Top 1.016: v44.2,57.91 45.59,57.91 48.39,60.71 v55.12,60.71
  Bottom 0.762: 5V/3.3V.1 38.86,50.93 38.61,51.18 38.61,53.85 42.67,57.91 v44.2,57.91
  Bottom 1.016: FET1.3 55.12,59.32 v55.12,60.71
N$19
  Bottom 1.016: D1.3 54.86,55.26 R32.1
N$42
  Bottom 0.254: LCD.47 43.79,23.41 R20.2
  Bottom 1.016: R20.2 R19.2
N$123
  Bottom 0.508: U2.1 50.48,45.1 50.93,45.1
  Bottom 1.016: D5.A 51.31,42.43 51.31,38.88 | C14.1 51.31,38.88 | 51.31,38.88 C13.2
  Bottom 1.27: L2.2 53.98,45.1 51.31,45.1 | 51.31,45.1 50.93,45.1 | 51.31,42.43 51.31,45.1
N$126  (via drill 0.6)
  Top 1.016: v47.75,45.1 47.75,47.39 v47.37,47.77
  Bottom 0.508: U2.3 48.58,45.1 48.26,45.1
  Bottom 1.016: v47.75,45.1 48.26,45.1 | v47.37,47.77 R26.1 R18.1
RESET
  Bottom 0.254: C20.1 43.56,31.13 42.29,29.86 LCD.44
  Bottom 1.016: C20.1 R23.2
TPX1  (via drill 0.6)
  Top 1.016: v3.43,52.47 v7.62,52.47
  Bottom 0.254: v3.43,52.47 1.14,50.18 1.14,21.35 2.41,20.08 R27.2
  Bottom 0.508: LCD.51 4.83,9.53 R27.2
  Bottom 1.016: v7.62,52.47 LCD_CON.37
TPX2  (via drill 0.6)
  Top 1.016: v2.79,21.99 6.22,21.99 v7.62,20.59
  Bottom 0.254: 6.35,69.48 6.35,53.35 2.16,49.16 2.16,25.03 2.79,24.4
  Bottom 0.508: LCD.53 7.24,9.78 7.24,18.94 7.62,19.32 v7.62,20.59
  Bottom 0.762: v2.79,21.99 2.79,24.4
  Bottom 1.016: LCD_CON.38 7.62,70.75 6.35,69.48
TPY1
  Bottom 0.254: R28.2 6.35,20.21 5.59,20.97 2.41,20.97 1.65,21.73 1.65,49.42 5.08,52.85 5.08,54.24
  Bottom 0.508: LCD.52 6.35,9.27 R28.2
  Bottom 1.016: 5.08,54.24 LCD_CON.39
TPY2  (via drill 0.6)
  Top 1.016: v8.26,18.3 v2.29,18.3
  Bottom 0.254: 3.81,69.48 3.81,54.12 0.64,50.94 0.64,20.97 2.29,19.32
  Bottom 0.508: v2.29,18.3 2.29,19.32 | LCD.54 8.26,10.03 v8.26,18.3
  Bottom 1.016: LCD_CON.40 5.08,70.75 3.81,69.48
VCC  (via drill 0.6, 0.6 pad 1.02)
  Top 1.016: v47.88,36.46 47.88,40.91 48.51,41.54 50.16,41.54 50.93,42.31 50.93,51.45 49.53,52.85 | v7.75,46.12 v14.35,46.12 42.05,46.12 42.93,46.99 42.93,52.85 | 49.53,52.85 v49.53,57.93 | 15.88,30.5 v15.88,21.86 15.88,12.83 17.27,11.43 PWR.5 | 15.88,30.5 v15.88,33.54 | 15.88,30.5 v21.46,30.5 | 42.93,52.85 49.53,52.85 | 42.93,52.85 v42.91,52.85
  Bottom 0.254: R19.1 45.34,25.03 44.58,25.8 44.58,31.89 45.34,32.65 R23.1 | LCD.7 23.79,27.15 22.23,28.72
  Bottom 0.508: 47.62,36.46 47.62,33.29 46.99,32.65 R23.1
  Bottom 0.762: 5V/3.3V.3 42.55,53.21 v42.91,52.85
  Bottom 1.016: 45.47,36.46 R24.1 | 45.47,36.46 R25.1 | 45.47,36.46 47.62,36.46 v47.88,36.46 | FET2.3 49.53,59.28 v49.53,57.93 | 22.23,28.72 C1.1 20.32,28.72 C2.1 v21.46,30.5 | 15.88,37.1 15.88,38.62 | 15.88,38.62 R5.1 | 15.88,38.62 15.88,44.59 v14.35,46.12 | v7.75,46.12 R13.2 | R6.1 v15.88,33.54 15.88,37.1 | 15.88,37.1 R4.1 | v15.88,21.86 R28.1 R27.1
VCOM  (via drill 0.6)
  Top 0.508: 43.31,16.89 46.23,13.97 54.36,13.97
  Top 1.016: v23.75,19.45 v43.31,19.45 43.31,16.89 | 54.36,13.97 PWR.4
  Bottom 0.254: C19.1 43.56,26.56 42.8,25.8 42.8,22.75 43.29,22.26 LCD.46 43.29,19.43 v43.31,19.45 | v23.75,19.45 23.29,19.91 LCD.6 23.29,24.08 22.61,24.77
  Bottom 0.762: Z4.1 21.34,26.04 22.61,24.77
  Bottom 1.016: R22.2 R29.1 C19.1
VLED+  (via drill 0.6)
  Top 1.016: v5.59,28.21 v5.59,36.97
  Bottom 0.254: 20.79,22.79 LCD.1 | LCD.2 21.29,22.29 21.16,22.42
  Bottom 0.508: v5.59,36.97 U1.5 | 5.59,24.14 6.73,23 20.57,23 20.79,22.79 21.16,22.42
  Bottom 1.016: C5.1 C4.1 9.91,28.21 | 9.91,28.21 D2.K v5.59,28.21 5.59,24.14 | 9.91,28.21 C3.1
VLED-  (via drill 0.6)
  Top 1.016: v7.87,24.27 v7.87,39.77
  Bottom 0.254: 21.79,23.44 LCD.3 | LCD.4 22.29,22.94 22.15,23.08
  Bottom 0.508: 22.15,23.08 21.79,23.44 21.46,23.76 8.38,23.76 v7.87,24.27
  Bottom 1.016: R8.2 v7.87,39.77 R12.1

### Text on the board
Top: Da razpe4atam platkata!!!
tNames: Da se iztrie beliq pe4at na LCD-to v TopSilk!
bNames: 1 | WWW.OLIMEX.COM/DEV | MOD-LCD7"-TS | Rev.B | (C) 2012 | +16V | +10.4V | (5V/3.3V) | DCDC_VCC | +3.8V | +3.3V | -6.8V | GND | GND